# EAGLE design yalc (EAGLE 6.3)
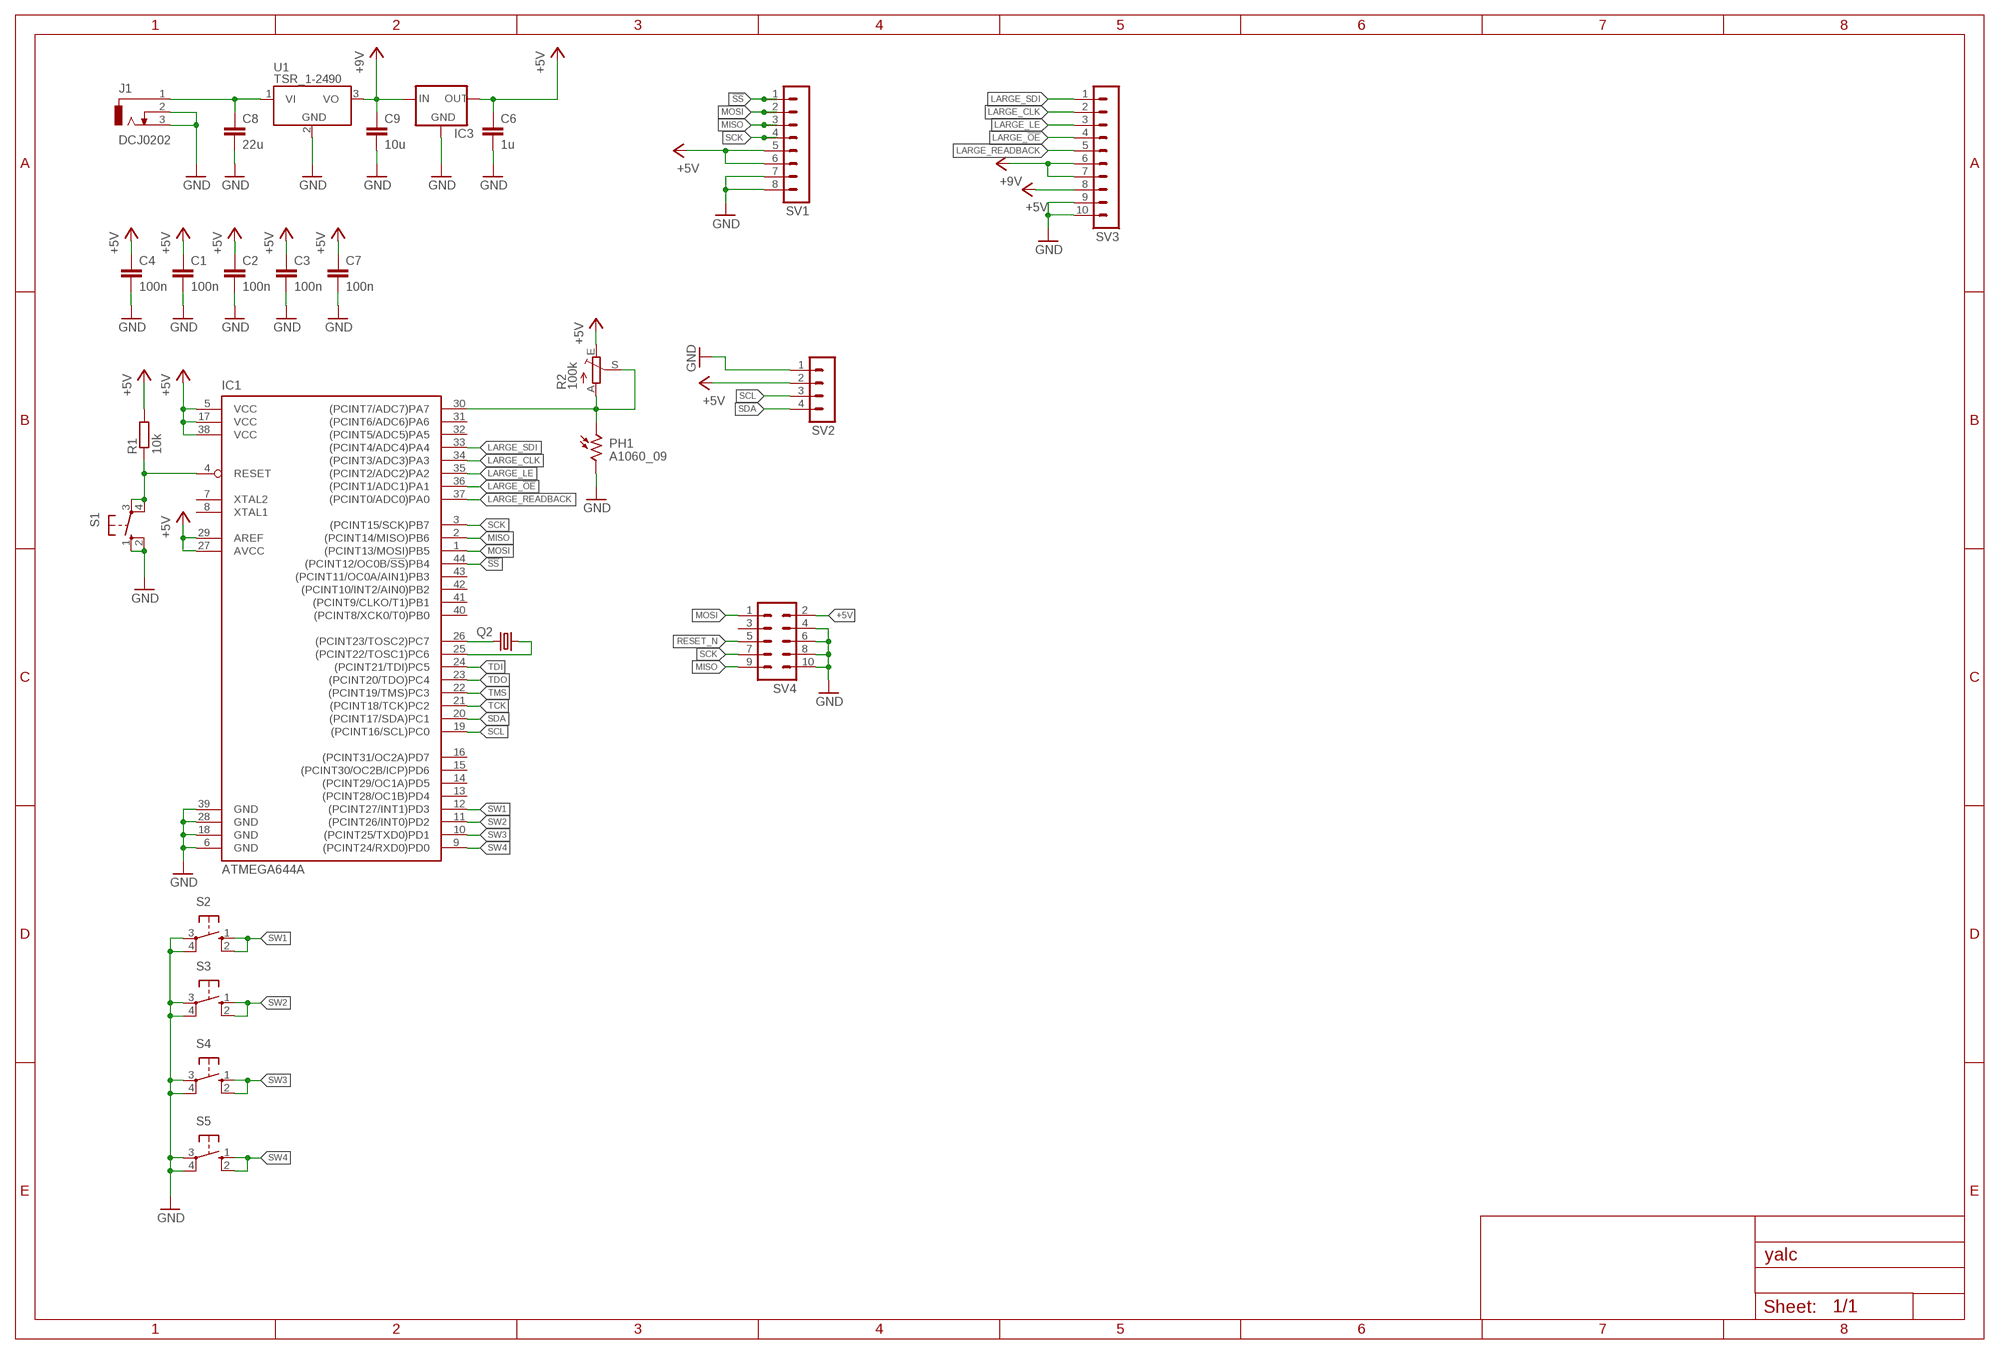
[diagram p0: schematic, sheet 1]

## Parts
C1  100n  C-EUC0805  [C0805]
C2  100n  C-EUC0805  [C0805]
C3  100n  C-EUC0805  [C0805]
C4  100n  C-EUC0805  [C0805]
C6  1u  C-EUC1206K  [C1206K]
C7  100n  C-EUC0805  [C0805]
C8  22u  C-EUC1206K  [C1206K]
C9  10u  C-EUC1206K  [C1206K]
IC1  ATMEGA644A  [TQFP44]
IC3  LFXXCVL  [TO220L1]
J1  DCJ0202  [DCJ0202]
PH1  A1060_09  [T0-46-A10XX]
Q2  CRYSTALTC26H  [TC26H]
R1  10k  R-EU_R0805  [R0805]
R2  100k  TRIM_EU-ECP10S  [ECP10S]
S1  10-XX  [B3F-10XX]
S2  10-XX  [B3F-10XX]
S3  10-XX  [B3F-10XX]
S4  10-XX  [B3F-10XX]
S5  10-XX  [B3F-10XX]
SV1  MA08-1W  [MA08-1W]
SV2  MA04-1  [MA04-1]
SV3  MA10-1W  [MA10-1W]
SV4  ML10  [ML10]
U1  TSR_1-2490  [TSR-1]

## Nets
!SS: IC1.44((PCINT12/OC0B/!SS!)PB4) SV1.1
+5V: C1.1 C2.1 C3.1 C4.1 C6.1 C7.1 IC1.5(VCC) IC1.17(VCC) IC1.27(AVCC) IC1.29(AREF) IC1.38(VCC) IC3.3(OUT) R1.2 R2.E SV1.5 SV1.6 SV2.2 SV3.8 SV4.2
+9V: C9.1 IC3.1(IN) SV3.6 SV3.7 U1.3(VO)
GND: C1.2 C2.2 C3.2 C4.2 C6.2 C7.2 C8.2 C9.2 IC1.6(GND) IC1.18(GND) IC1.28(GND) IC1.39(GND) IC3.2(GND) J1.2 J1.3 PH1.2 S1.1(S) S1.2(S1) S2.3(P) S2.4(P1) S3.3(P) S3.4(P1) S4.3(P) S4.4(P1) S5.3(P) S5.4(P1) SV1.7 SV1.8 SV2.1 SV3.9 SV3.10 SV4.4 SV4.6 SV4.8 SV4.10 U1.2(GND)
LARGE_!OE: IC1.36((PCINT1/ADC1)PA1) SV3.4
LARGE_CLK: IC1.34((PCINT3/ADC3)PA3) SV3.2
LARGE_LE: IC1.35((PCINT2/ADC2)PA2) SV3.3
LARGE_READBACK: IC1.37((PCINT0/ADC0)PA0) SV3.5
LARGE_SDI: IC1.33((PCINT4/ADC4)PA4) SV3.1
MISO: IC1.2((PCINT14/MISO)PB6) SV1.3 SV4.9
MOSI: IC1.1((PCINT13/MOSI)PB5) SV1.2 SV4.1
N$1: IC1.30((PCINT7/ADC7)PA7) PH1.1 R2.A R2.S
N$2: IC1.26((PCINT23/TOSC2)PC7) Q2.2
N$7: IC1.25((PCINT22/TOSC1)PC6) Q2.1
RESET_N: IC1.4(RESET) R1.1 S1.3(P) S1.4(P1) SV4.5
SCK: IC1.3((PCINT15/SCK)PB7) SV1.4 SV4.7
SCL: IC1.19((PCINT16/SCL)PC0) SV2.3
SDA: IC1.20((PCINT17/SDA)PC1) SV2.4
SW1: IC1.12((PCINT27/INT1)PD3) S2.1(S) S2.2(S1)
SW2: IC1.11((PCINT26/INT0)PD2) S3.1(S) S3.2(S1)
SW3: IC1.10((PCINT25/TXD0)PD1) S4.1(S) S4.2(S1)
SW4: IC1.9((PCINT24/RXD0)PD0) S5.1(S) S5.2(S1)
TCK: IC1.21((PCINT18/TCK)PC2)
TDI: IC1.24((PCINT21/TDI)PC5)
TDO: IC1.23((PCINT20/TDO)PC4)
TMS: IC1.22((PCINT19/TMS)PC3)
VI: C8.1 J1.1 U1.1(VI)
Unconnected: IC1.7(XTAL2) IC1.8(XTAL1) IC1.13((PCINT28/OC1B)PD4) IC1.14((PCINT29/OC1A)PD5) IC1.15((PCINT30/OC2B/ICP)PD6) IC1.16((PCINT31/OC2A)PD7) IC1.31((PCINT6/ADC6)PA6) IC1.32((PCINT5/ADC5)PA5) IC1.40((PCINT8/XCK0/T0)PB0) IC1.41((PCINT9/CLKO/T1)PB1) IC1.42((PCINT10/INT2/AIN0)PB2) IC1.43((PCINT11/OC0A/AIN1)PB3) SV4.3

## Library data of the parts
C1-C4 C6-C9 = rcl:C-EU: CAPACITOR, European symbol
IC1 = atmel:ATMEGA644: 8-bit Microcontroller with 64K Bytes In-System Programmable Flash Source: http://www.atmel.com/dyn/resources/prod_documents/doc2593.pdf; MPN: ATMEGA644PV-10AU; OC_FARNELL: 1455123; OC_NEWARK: 58M3748
IC3 = lf33:LFXXCV: VOLTAGE REGULATOR
J1 = con-jack:DCJ0202: DC POWER JACK Source: DCJ0202.pdf; OC_FARNELL: unknown; OC_NEWARK: unknown
PH1 = photo-elements:A10: Sensor Robust Light Sensing Applications Outdoor Light Sensing Application Source: http://optoelectronics.perkinelmer.com/content/Datasheets/DTS_PhotocellsA1050.pdf
Q2 = crystal:CRYSTAL: CRYSTAL; OC_FARNELL: unknown; OC_NEWARK: unknown
R1 = rcl:R-EU_: RESISTOR, European symbol
R2 = pot:TRIM_EU-: POTENTIOMETER
S1-S5 = switch-omron:10-XX: OMRON SWITCH; MPN: B3F-1000; OC_FARNELL: 176432; OC_NEWARK: 36M3542
SV1 = con-lstb:MA08-1W: PIN HEADER; OC_FARNELL: unknown; OC_NEWARK: unknown
SV2 = con-lstb:MA04-1: PIN HEADER; OC_FARNELL: unknown; OC_NEWARK: unknown
SV3 = con-lstb:MA10-1W: PIN HEADER; OC_FARNELL: unknown; OC_NEWARK: unknown
SV4 = con-ml:ML10: HARTING; OC_FARNELL: unknown; OC_NEWARK: unknown
U1 = _traco_tsr-1:TSR_1-*: TRACO TSR-1 Series Point-of-Load DC/DC-Converters Vi max. 36 V; Vo = (1.2 .. 15)V ±2%; Io = 0 .. 1 A SIP-Package (drop-in replacement for 78xx linear voltage regulators in TO220-package, vertically assembled) Source: www.tracopower.com Technologies: TSR 1- Vi (V) Vo (V) ±2% Io = 0 .. 1 A 24_ ( generic ) 2412 4.6 .. 36 1.2 2415 4.6 .. 36 1.5 2418 4.6 .. 36 1.8 2425 4.6 .. 36 2.5 2433 4.75.. 36 3.3 2450 6.5 .. 36 5.0 2465 9.0 .. 36 6.5 2490 12 .. 36 9.0 24120 15 .. 36 12 24150 18 .. 36 15 Author: Dipl.-Ing. FH Rainer Bayer HHN Hochschule Heilbronn, rainer.bayer@hs-heilbronn.de Ingenieurbüro ing-rb, mail@ing-rb.de

## Board
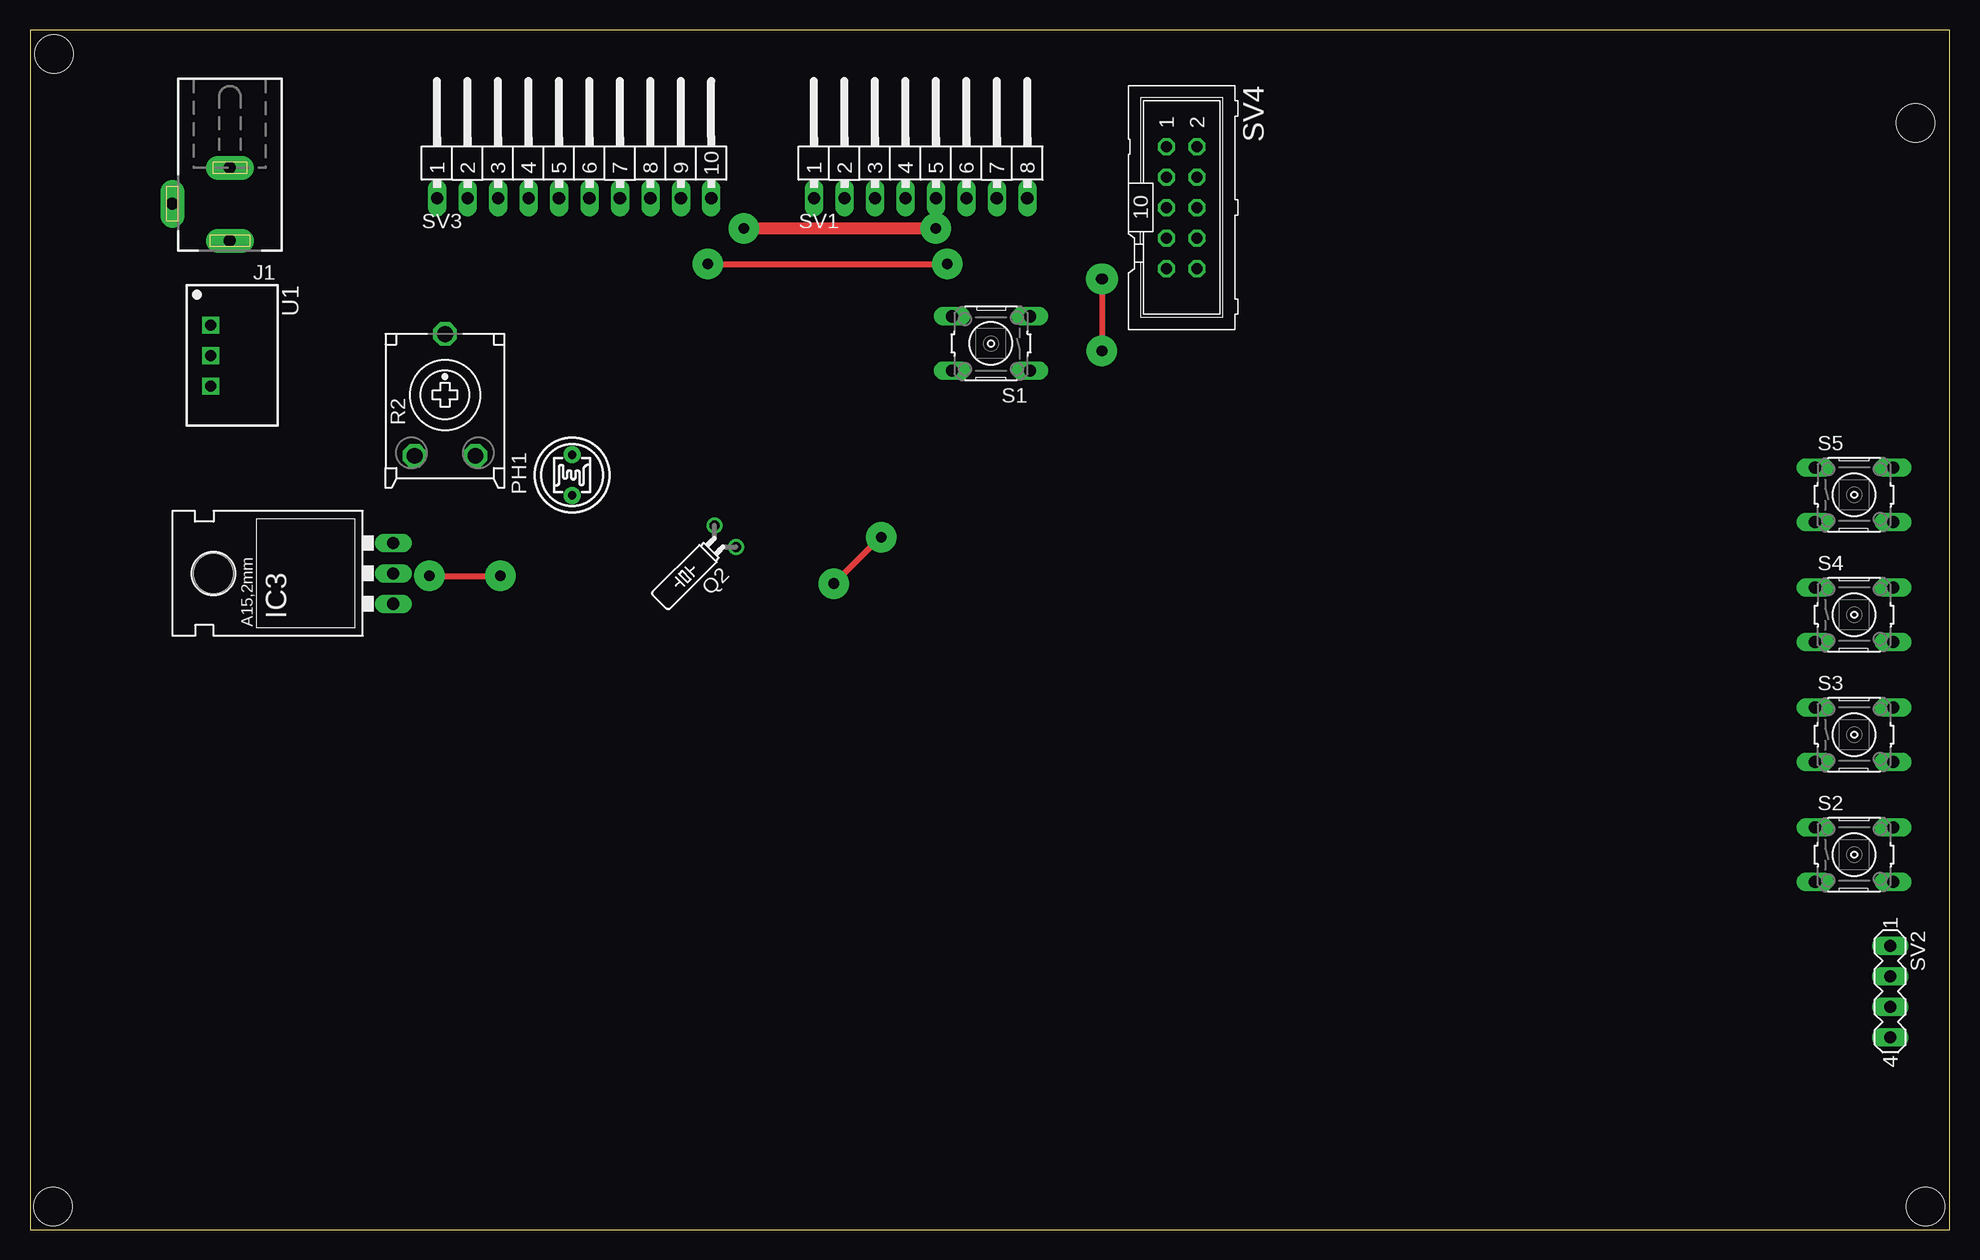
[diagram p1: board, top side]
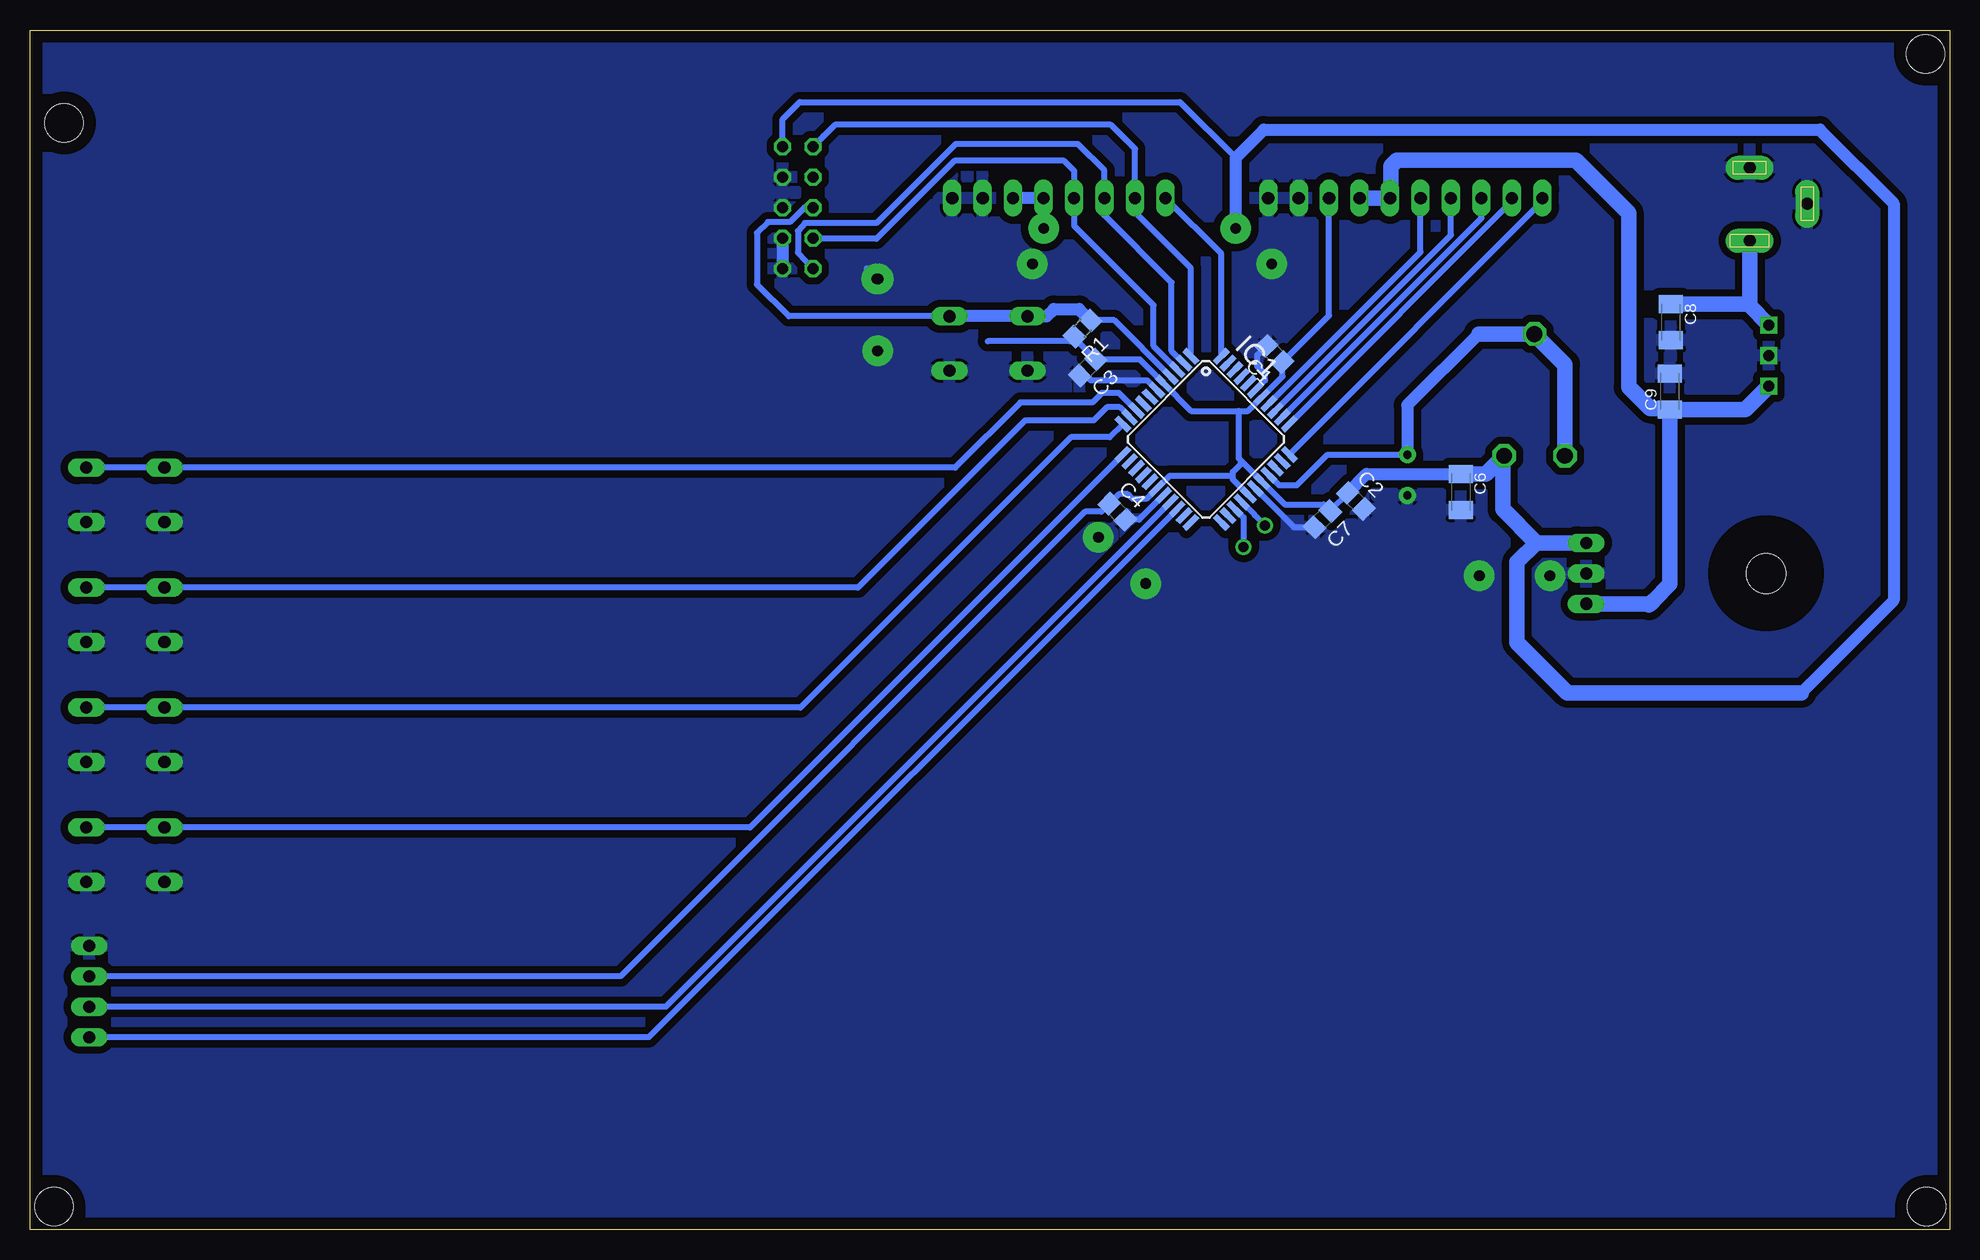
[diagram p2: board, bottom side, seen from below]

Size 160 x 100 mm. Coordinates in mm from the lower left corner, seen from the top.
Outline: 0,0 160,0 160,100 0,100 0,0
Copper layers (1*16): Top 0.035mm / dielectric 1.5mm / Bottom 0.035mm
Design rules "default": minimum track width 10mil, minimum drill 24mil, track to track 8mil, track to pad 8mil, pad to pad 8mil, via to via 8mil, smd to smd 8mil, copper to edge 40mil, drill to drill 8mil, minimum pad ring 10mil, minimum via ring 8mil, stop-mask expansion 4mil, vias tented up to drill 0mil, thermal gap 10mil
Holes 3.2 mm at 2,98 157.15,92.25 158,1.9 1.9,1.9

### Footprints (pad centres in the part's own frame; a part is rotated, then mirrored left to right if it is on the bottom)
C0805 = smd 1.3 x 1.5: 1 -0.95,0; 2 0.95,0
C1206K = smd 1.5 x 2: 1 -1.5,0; 2 1.5,0
TQFP44 = smd 1.5 x 0.5: 1 -5.8,4; 2 -5.8,3.2; 3 -5.8,2.4; 4 -5.8,1.6; 5 -5.8,0.8; 6 -5.8,0; 7 -5.8,-0.8; 8 -5.8,-1.6; 9 -5.8,-2.4; 10 -5.8,-3.2; 11 -5.8,-4; 23 5.8,-4; 24 5.8,-3.2; 25 5.8,-2.4; 26 5.8,-1.6; 27 5.8,-0.8; 28 5.8,0; 29 5.8,0.8; 30 5.8,1.6; 31 5.8,2.4; 32 5.8,3.2; 33 5.8,4 | smd 0.5 x 1.5: 12 -4,-5.8; 13 -3.2,-5.8; 14 -2.4,-5.8; 15 -1.6,-5.8; 16 -0.8,-5.8; 17 0,-5.8; 18 0.8,-5.8; 19 1.6,-5.8; 20 2.4,-5.8; 21 3.2,-5.8; 22 4,-5.8; 34 4,5.8; 35 3.2,5.8; 36 2.4,5.8; 37 1.6,5.8; 38 0.8,5.8; 39 0,5.8; 40 -0.8,5.8; 41 -1.6,5.8; 42 -2.4,5.8; 43 -3.2,5.8; 44 -4,5.8
TO220L1 = drill 1.016 long: 1 -2.54,-3.81; 2 0,-3.81; 3 2.54,-3.81 | hole 3.302: 0,11.176
DCJ0202 = drill 1 pad 2 long: 1 0,3.1; 2 4.8,0; 3 0,-3
T0-46-A10XX = drill 0.7 pad 1.4: 1 -1.7,0; 2 1.7,0
TC26H = drill 0.813: 1 -1.27,0; 2 1.27,0
R0805 = smd 1.3 x 1.5: 1 -0.95,0; 2 0.95,0
ECP10S = drill 1.321 octagon: A -2.54,-5.08; E 2.54,-5.08; S 0,5.08
B3F-10XX = drill 1.016 long: 1 -3.251,2.261; 2 3.251,2.261; 3 -3.251,-2.261; 4 3.251,-2.261
MA08-1W = drill 1.016 long: 1 -8.89,0; 2 -6.35,0; 3 -3.81,0; 4 -1.27,0; 5 1.27,0; 6 3.81,0; 7 6.35,0; 8 8.89,0
MA04-1 = drill 1.016 long: 1 -3.81,0; 2 -1.27,0; 3 1.27,0; 4 3.81,0
MA10-1W = drill 1.016 long: 1 -11.43,0; 2 -8.89,0; 3 -6.35,0; 4 -3.81,0; 5 -1.27,0; 6 1.27,0; 7 3.81,0; 8 6.35,0; 9 8.89,0; 10 11.43,0
ML10 = drill 0.914 octagon: 1 -5.08,-1.27; 2 -5.08,1.27; 3 -2.54,-1.27; 4 -2.54,1.27; 5 0,-1.27; 6 0,1.27; 7 2.54,-1.27; 8 2.54,1.27; 9 5.08,-1.27; 10 5.08,1.27
TSR-1 = drill 0.9 square: 1 -2.54,0; 2 0,0; 3 2.54,0

### Placement (x,y rotation side)
C1  56.27,72.99 135 bottom
C2  49.49,60.74 315 bottom
C3  71.83,71.86 225 bottom
C4  69.36,59.84 315 bottom
C6  40.75,61.48 270 bottom
C7  52.27,59.22 225 bottom
C8  23.22,75.63 270 bottom
C9  23.3,69.86 90 bottom
IC1  61.97,65.88 315 bottom
IC3  26.47,54.7 90 top
J1  16.66,85.52 180 top
PH1  45.19,62.9 270 top
Q2  57.95,57.8 135 top
R1  72.26,75.12 225 bottom
R2  34.59,69.58 0 top
S1  80.1,73.87 180 top
S2  152.05,31.25 0 top
S3  152.05,41.25 0 top
S4  152.05,51.25 0 top
S5  152.05,61.25 0 top
SV1  74.24,85.99 0 top
SV2  155.06,19.84 270 top
SV3  45.36,85.99 0 top
SV4  96,85.2 270 top
U1  15.05,72.86 270 top

### Tracks (layer width: path | path; a pad name or v marks a point on that pad's centre or on a via)
!SS
  Bottom 0.5: IC1.44 60.7,81.34 SV1.1
+5V  (via drill 0.9 pad 2.54)
  Top 1.016: v75.5,83.45 v59.5,83.45
  Bottom 0.5: SV3.8 51.71,76.21 C1.1 55.6,71.12 IC1.38 58.47,68.25 59.25,68.25 | 59.25,68.25 63.21,68.25 IC1.5 67.49,72.53 C3.1 72.93,74.31 R1.2 73.33,74.05 80.15,74.05 | 59.08,64.12 IC1.29 55.4,60.45 52.16,60.45 C7.1 51.6,59.98 C2.1 | 59.08,64.12 59.25,64.29 59.25,68.25 | IC1.27 59.75,62.53 59.75,62.85 | 59.75,62.85 59.75,63.15 59.08,63.82 59.08,64.12 | 59.75,62.85 65,62.85 IC1.17 66.95,60.9 68.1,60.9 68.5,61.3 69.25,61.3 C4.1 70.69,59.85 72.05,59.85 110.79,21.11 SV2.2 | SV4.2 97.27,92.58 95.85,94 64.15,94 59.5,89.35
  Bottom 1.016: SV1.5 75.45,86.05 | 12.35,44.75 4.65,52.45 4.65,85.55 10.8,91.7 57.15,91.7 59.5,89.35 v59.5,83.45 | SV1.5 SV1.6 | C2.1 48.59,62.98 C6.1 | SV1.5 v75.51,83.46 v75.5,83.45
  Bottom 1.3: IC3.3 34.44,57.24 | 34.44,57.24 37.25,60.05 37.25,64.38 R2.E 38.65,62.98 C6.1 | 12.35,44.75 31.85,44.75 36.05,48.95 36.05,55.63 34.44,57.24
+9V
  Bottom 0.254: 24.94,52.16 24.85,52.63 24.66,52.44
  Bottom 1.3: SV3.7 SV3.6 46.55,86.07 46.55,88.65 46.05,89.15 31.15,89.15 26.75,84.75 26.75,70.25 24.95,68.45 23.39,68.45 C9.1 | C9.1 17.01,68.36 U1.3 | C9.1 23.3,53.8 24.66,52.44 24.94,52.16 | IC3.1 24.94,52.16 | 25.05,52.05 24.94,52.16
GND  (via drill 0.9 pad 2.54)
  Top 0.5: v33.3,54.5 v39.2,54.5 | v67,53.85 70.85,57.7 v70.95,57.7 | v56.5,80.5 v76.45,80.5 | v89.35,73.25 89.4,73.3 89.4,79.15 v89.3,79.25
  Bottom 0.254: SV3.10 56.6,85.65 56.6,85.99
  Bottom 0.5: IC1.28 57.87,61.77 54.65,58.55 C7.2 | IC1.18 67.55,59.17 C4.2 | IC1.39 57.05,70.8 57.05,71.3 57.7,71.95 57.7,72.9 C1.2 | IC1.6 66.89,70.8 71.6,70.8 71.99,71.19 C3.2 | 90.27,80.12 v89.4,79.25
  Bottom 1.016: SV4.8 SV4.10
  pour Bottom (isolate 0.61): 160,99.9 160,0 0.1,0 0,98.3 0,99.9
LARGE_!OE
  Bottom 0.5: IC1.36 41.55,82.91 SV3.4
LARGE_CLK
  Bottom 0.5: IC1.34 36.47,85.72 SV3.2
LARGE_LE
  Bottom 0.5: IC1.35 39.01,84.31 SV3.3
LARGE_READBACK
  Bottom 0.5: IC1.37 44.09,81.5 SV3.5
LARGE_SDI
  Bottom 0.5: IC1.33 33.93,85.72 SV3.1
MISO
  Bottom 0.5: IC1.2 63.84,72.24 64.85,73.25 64.85,78.95 70.45,84.55 70.45,85.97 | 70.45,85.97 SV1.3 | 70.45,85.97 70.45,88.3 72.65,90.5 82.85,90.5 89.45,83.9 95.4,83.9 96,83.25 96,81.44 SV4.9 94.71,80.1 94.9,80.1
MOSI
  Bottom 0.5: IC1.1 63.24,80.14 67.75,84.65 67.75,85.85 SV1.2 67.89,90.09 69.9,92.1 92.91,92.1 SV4.1 93.86,91.15
N$1
  Bottom 0.5: IC1.30 55.88,62.05 54.4,62.05 51.85,64.6 PH1.1
  Bottom 1.016: 39.25,74.66 45.19,68.72 PH1.1
  Bottom 1.3: R2.A 32.05,72.12 R2.S 39.25,74.66
N$2
  Bottom 0.5: IC1.26 57.9,59.55 Q2.2
N$7
  Bottom 0.5: IC1.25 58.85,59.36 Q2.1
RESET_N
  Bottom 0.5: 70.82,75.79 R1.1 69.62,75.79 IC1.4 | S1.3 96.75,76.13 99.4,78.78 99.4,83.1 98.5,84 96.65,84 95.45,85.2 SV4.5
  Bottom 1.016: S1.3 S1.4 75.27,76.13 74.65,76.75 72.55,76.75 R1.1
SCK
  Bottom 0.5: IC1.3 66.35,73.65 66.35,77.05 72.95,83.65 72.95,85.97 | 72.95,85.97 SV1.4 72.97,83.93 | 72.95,85.97 72.95,88.25 73.8,89.1 82.95,89.1 89.45,82.6 94.67,82.6 SV4.7
SCL
  Bottom 0.5: IC1.19 107.02,18.57 SV2.3
SDA
  Bottom 0.5: IC1.20 108.43,16.03 SV2.4
SW1
  Bottom 0.5: IC1.12 100,33.51 S2.1 S2.2
SW2
  Bottom 0.5: IC1.11 70,66.05 73.25,66.05 95.79,43.51 S3.1 S3.2
SW3
  Bottom 0.5: IC1.10 69.17,68.55 70.25,68.55 71.35,67.45 77.05,67.45 90.99,53.51 S4.1 S4.2
SW4
  Bottom 0.5: IC1.9 69.23,69.75 70.65,69.75 71.45,68.95 77.45,68.95 82.89,63.51 S5.1 S5.2
VI
  Bottom 1.3: J1.1 16.66,77.01 | 16.66,77.01 U1.1 | C8.1 16.78,77.13 16.66,77.01